# EAGLE design v3_NoD_2 (EAGLE 9.5.2)
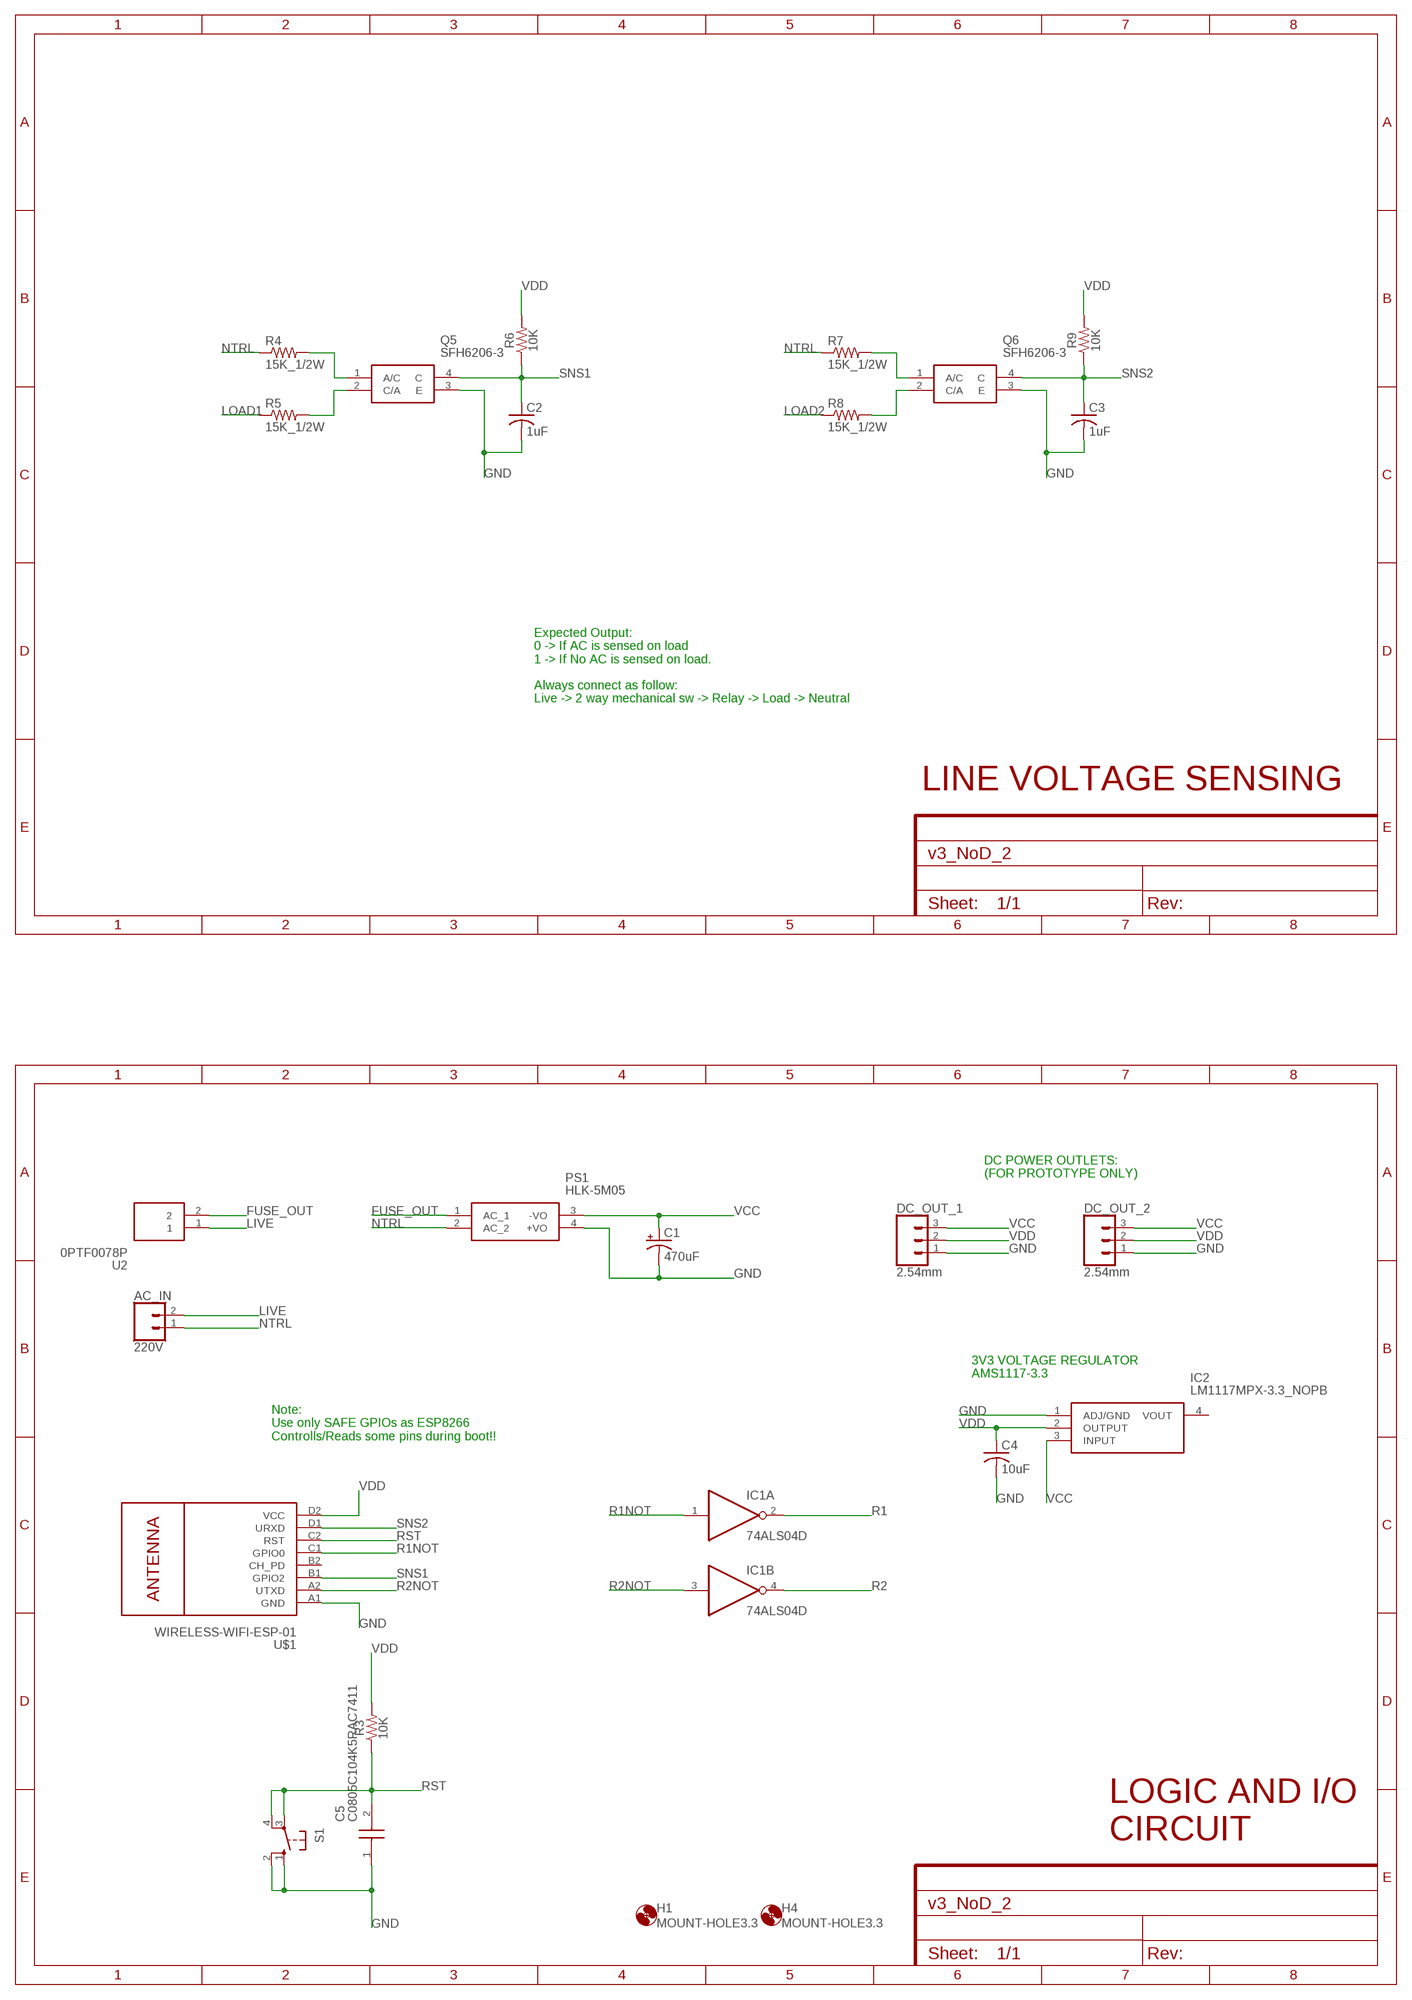
[diagram p0: schematic, sheet 1, part 1 of 2]
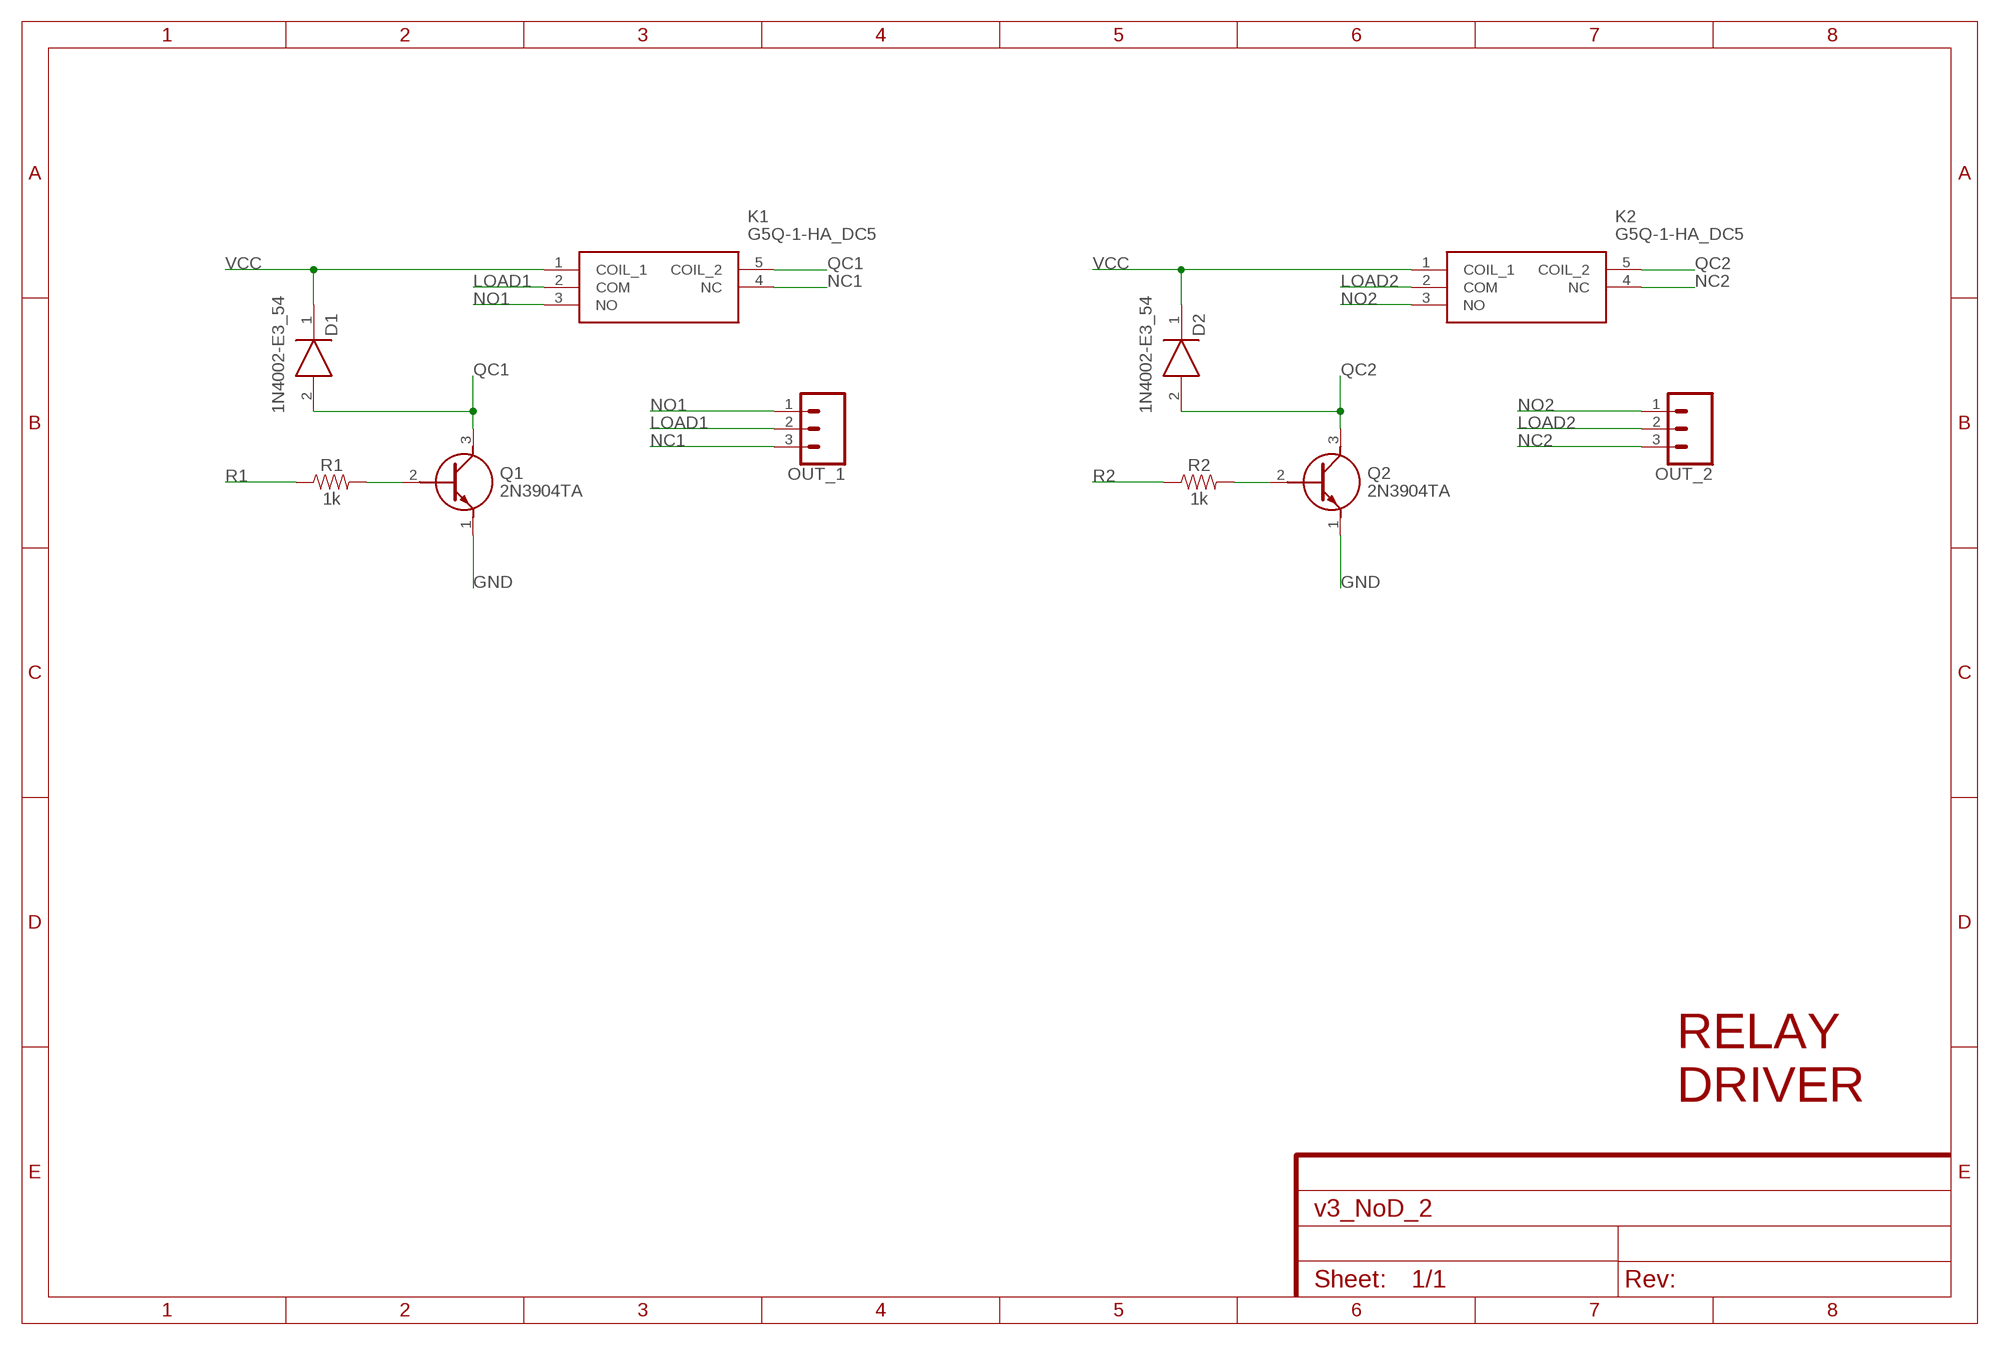
[diagram p1: schematic, sheet 1, part 2 of 2]

## Parts
AC_IN  220V  CONN_025MM  [SCREWTERMINAL-5MM-2]
C1  470uF  1000UF-RADIAL-5MM-35V-20%-KIT  [CPOL-RADIAL-5MM-10MM-KIT]
C2  1uF  C-USC0805  [C0805]
C3  1uF  C-USC0805  [C0805]
C4  10uF  C-USC0805  [C0805]
C5  C0805C104K5RAC7411  [CAPC2012X88N]
D1  1N4002-E3_54  [DIOAD1405W86L465D235]
D2  1N4002-E3_54  [DIOAD1405W86L465D235]
DC_OUT_1  2.54mm  CONN_03  [1X03]
DC_OUT_2  2.54mm  CONN_03  [1X03]
H1  MOUNT-HOLE3.3  [3,3]
H4  MOUNT-HOLE3.3  [3,3]
IC1  74ALS04D  [SO14]
IC2  LM1117MPX-3.3_NOPB  [SOT230P700X180-4N]
K1  G5Q-1-HA_DC5  [G5Q1EU12DC]
K2  G5Q-1-HA_DC5  [G5Q1EU12DC]
OUT_1  CONN_03-SCREW-5MM  [SCREWTERMINAL-5MM-3]
OUT_2  CONN_03-SCREW-5MM  [SCREWTERMINAL-5MM-3]
PS1  HLK-5M05  [HLK5M05]
Q1  2N3904TA  [BC33740TA]
Q2  2N3904TA  [BC33740TA]
Q5  SFH6206-3  [SOP254P1005X410-4N]
Q6  SFH6206-3  [SOP254P1005X410-4N]
R1  1k  1KOHM-0603-1/10W-1%  [0603]
R2  1k  1KOHM-0603-1/10W-1%  [0603]
R3  10K  1KOHM-0603-1/10W-1%  [0603]
R4  15K_1/2W  R-US_R1210  [R1210]
R5  15K_1/2W  R-US_R1210  [R1210]
R6  10K  1KOHM-0603-1/10W-1%  [0603]
R7  15K_1/2W  R-US_R1210  [R1210]
R8  15K_1/2W  R-US_R1210  [R1210]
R9  10K  1KOHM-0603-1/10W-1%  [0603]
S1  10-XX  [B3F-10XX]
U2  0PTF0078P  [0PTF0078P]
U$1  WIRELESS-WIFI-ESP-01  [WIRELESS-WIFI-ESP-01]

## Nets
FUSE_OUT: PS1.1(AC_1) U2.2
GND: C1.- C2.2 C3.2 C4.2 C5.1 DC_OUT_1.1 DC_OUT_2.1 IC2.1(ADJ/GND) PS1.4(+VO) Q1.1(E) Q2.1(E) Q5.3(E) Q6.3(E) S1.1(S) S1.2(S1) U$1.A1(GND)
LIVE: AC_IN.2 U2.1
LOAD1: K1.2(COM) OUT_1.2 R5.1
LOAD2: K2.2(COM) OUT_2.2 R8.1
N$1: Q5.1(A/C) R4.2
N$2: Q5.2(C/A) R5.2
N$3: Q6.1(A/C) R7.2
N$4: Q1.2(B) R1.2
N$5: Q2.2(B) R2.2
N$6: Q6.2(C/A) R8.2
NC1: K1.4(NC) OUT_1.3
NC2: K2.4(NC) OUT_2.3
NO1: K1.3(NO) OUT_1.1
NO2: K2.3(NO) OUT_2.1
NTRL: AC_IN.1 PS1.2(AC_2) R4.1 R7.1
QC1: D1.2(A) K1.5(COIL_2) Q1.3(C)
QC2: D2.2(A) K2.5(COIL_2) Q2.3(C)
R1: IC1.2(A:O) R1.1
R1NOT: IC1.1(A:I) U$1.C1(GPIO0)
R2: IC1.4(B:O) R2.1
R2NOT: IC1.3(B:I) U$1.A2(UTXD)
RST: C5.2 R3.1 S1.3(P) S1.4(P1) U$1.C2(RST)
SNS1: C2.1 Q5.4(C) R6.1 U$1.B1(GPIO2)
SNS2: C3.1 Q6.4(C) R9.1 U$1.D1(URXD)
VCC: C1.+ D1.1(K) D2.1(K) DC_OUT_1.3 DC_OUT_2.3 IC2.3(INPUT) K1.1(COIL_1) K2.1(COIL_1) PS1.3(-VO)
VDD: C4.1 DC_OUT_1.2 DC_OUT_2.2 IC2.2(OUTPUT) R3.2 R6.2 R9.2 U$1.D2(VCC)
Unconnected: IC1.5(C:I) IC1.6(C:O) IC1.8(D:O) IC1.9(D:I) IC1.10(E:O) IC1.11(E:I) IC1.12(F:O) IC1.13(F:I) IC2.4(VOUT) U$1.B2(CH_PD)

## Notes on the sheet
- Expected Output:
  0 -> If AC is sensed on load
  1 -> If No AC is sensed on load.
  
  Always connect as follow:
  Live -> 2 way mechanical sw -> Relay -> Load -> Neutral
- LINE VOLTAGE SENSING
- DC POWER OUTLETS:
  (FOR PROTOTYPE ONLY)
- 3V3 VOLTAGE REGULATOR
  AMS1117-3.3
- Note:
  Use only SAFE GPIOs as ESP8266
  Controlls/Reads some pins during boot!!
- RELAY
  DRIVER
- LOGIC AND I/O
  CIRCUIT

## Power pins joined to a net without a drawn wire
GND: IC1.7(P:GND)
VCC: IC1.14(P:VCC)

## Library data of the parts
AC_IN = SparkFun-Connectors:CONN_02: Multi connection point. Often used as Generic Header-pin footprint for 0.1 inch spaced/style header connections On any of the 0.1 inch spaced packages, you can populate with these: Break Away Headers - Straight <https://www.sparkfun.com/products/116> (PRT-00116) Break Away Male Headers - Right Angle <https://www.sparkfun.com/products/553> (PRT-00553) Female Headers <https://www.sparkfun.com/products/115> (PRT-00115) Break Away Headers - Machine Pin <https://www.sparkfun.com/products/117> (PRT-00117) Break Away Female Headers - Swiss Machine Pin <https://www.sparkfun.com/products/743> (PRT-00743) For SCREWTERMINALS and SPRING TERMINALS visit here: Screw Terimnals on SparkFun.com <https://www.sparkfun.com/search/results?term=Screw+Terminals> (5mm/3.5mm/2.54mm spacing) This device is also useful as a general connection point to wire up your design to another part of your project. Our various solder wires solder well into these plated through hole pads. Hook-Up Wire - Assortment (Stranded, 22 AWG) <https://www.sparkfun.com/products/11375> (PRT-11375) Hook-Up Wire - Assortment (Solid Core, 22 AWG) <https://www.sparkfun.com/products/11367> (PRT-11367) View the entire wire category on our website here <https://www.sparkfun.com/categories/141> Special notes: Molex polarized connector foot print use with: PRT-08233 with associated crimp pins and housings. 2.54_SCREWTERM for use with PRT-10571. 3.5mm Screw Terminal footprints for PRT-08084 5mm Screw Terminal footprints for use with PRT-08432; SF_SKU: PRT-08432
C1 = SparkFun-Capacitors:1000UF: 1,000µF/1mF ceramic capacitors A capacitor is a passive two-terminal electrical component used to store electrical energy temporarily in an electric field. CAP-08070; PROD_ID: CAP-09538; VALUE: 1mf
C2-C4 = rcl:C-US: CAPACITOR, American symbol; SPICEPREFIX: C
C5 = SamacSys_Parts:C0805C104K5RAC7411: Cap Ceramic 0.1uF 50V X7R 10% Pad SMD 0805 125C T/R Source: Datasheet; DESCRIPTION: Cap Ceramic 0.1uF 50V X7R 10% Pad SMD 0805 125C T/R; HEIGHT: 0.88mm; MANUFACTURER_NAME: Kemet; MANUFACTURER_PART_NUMBER: C0805C104K5RAC7411; MOUSER_PART_NUMBER: 80-C0805C104K5RACLR; MOUSER_PRICE-STOCK: https://www.mouser.co.uk/ProductDetail/KEMET/C0805C104K5RAC7411?qs=jbRM9o5BbzPcVXF0wW9AYg%3D%3D
D1 D2 = SamacSys_Parts:1N4002-E3_54: VISHAY - 1N4002-E3/54 - STANDARD DIODE, 1A, 100V, DO-204AL, FULL REEL Source: Datasheet <https://componentsearchengine.com/Datasheets/2/1N4002-E3_54.pdf>; DESCRIPTION: VISHAY - 1N4002-E3/54 - STANDARD DIODE, 1A, 100V, DO-204AL, FULL REEL; HEIGHT: mm; MANUFACTURER_NAME: Vishay; MANUFACTURER_PART_NUMBER: 1N4002-E3/54; MOUSER_PART_NUMBER: 625-1N4002-E3/54; MOUSER_PRICE-STOCK: https://www.mouser.co.uk/ProductDetail/Vishay-Semiconductors/1N4002-E3-54?qs=N4vtoAxH%2FSqs13dJhGS5gw%3D%3D
DC_OUT_1 DC_OUT_2 = SparkFun-Connectors:CONN_03: Multi connection point. Often used as Generic Header-pin footprint for 0.1 inch spaced/style header connections On any of the 0.1 inch spaced packages, you can populate with these: Break Away Headers - Straight <https://www.sparkfun.com/products/116> (PRT-00116) Break Away Male Headers - Right Angle <https://www.sparkfun.com/products/553> (PRT-00553) Female Headers <https://www.sparkfun.com/products/115> (PRT-00115) Break Away Headers - Machine Pin <https://www.sparkfun.com/products/117> (PRT-00117) Break Away Female Headers - Swiss Machine Pin <https://www.sparkfun.com/products/743> (PRT-00743) Stackable Header - 3 Pin (Female, 0.1") <https://www.sparkfun.com/products/13875> (PRT-13875) For SCREWTERMINALS and SPRING TERMINALS visit here: Screw Terimnals on SparkFun.com <https://www.sparkfun.com/search/results?term=Screw+Terminals> (5mm/3.5mm/2.54mm spacing) This device is also useful as a general connection point to wire up your design to another part of your project. Our various solder wires solder well into these plated through hole pads. Hook-Up Wire - Assortment (Stranded, 22 AWG) <https://www.sparkfun.com/products/11375> (PRT-11375) Hook-Up Wire - Assortment (Solid Core, 22 AWG) <https://www.sparkfun.com/products/11367> (PRT-11367) View the entire wire category on our website here <https://www.sparkfun.com/categories/141> Special notes: Molex polarized connector foot print use with SKU : PRT-08232 with associated crimp pins and housings.; PROD_ID: XXX-00000; VALUE: 455-1750-1-ND
H1 H4 = holes:MOUNT-HOLE: MOUNTING HOLE with drill center marker
IC1 = 74xx-us:74*04: Hex INVERTER
IC2 = SamacSys_Parts:LM1117MPX-3.3_NOPB: Space saving 800-mA low-dropout linear regulator with internal current limit Source: Datasheet <http://www.ti.com/lit/ds/symlink/lm1117.pdf>; DESCRIPTION: Space saving 800-mA low-dropout linear regulator with internal current limit; HEIGHT: 1.8mm; MANUFACTURER_NAME: Texas Instruments; MANUFACTURER_PART_NUMBER: LM1117MPX-3.3/NOPB; MOUSER_PART_NUMBER: 926-LM1117MPX3.3NOPB; MOUSER_PRICE-STOCK: https://www.mouser.co.uk/ProductDetail/Texas-Instruments/LM1117MPX-33-NOPB?qs=X1J7HmVL2ZHRbBIxXi4utg%3D%3D
K1 K2 = SamacSys_Parts:G5Q-1-HA_DC5: General Purpose Relays PCB Power Relay Mini 1-pole 10A Source: Datasheet <https://omronfs.omron.com/en_US/ecb/products/pdf/en-g5q.pdf>; DESCRIPTION: General Purpose Relays PCB Power Relay Mini 1-pole 10A; HEIGHT: 15.8mm; MANUFACTURER_NAME: Omron Electronics; MANUFACTURER_PART_NUMBER: G5Q-1-HA DC5; MOUSER_PART_NUMBER: 653-G5Q-1-HADC5; MOUSER_PRICE-STOCK: https://www.mouser.co.uk/ProductDetail/Omron-Electronics/G5Q-1-HA-DC5?qs=xZ%2FP%252Ba9zWqZWP6NLX9Nrlg%3D%3D
OUT_1 OUT_2 = SparkFun-Connectors:CONN_03: Multi connection point. Often used as Generic Header-pin footprint for 0.1 inch spaced/style header connections On any of the 0.1 inch spaced packages, you can populate with these: Break Away Headers - Straight <https://www.sparkfun.com/products/116> (PRT-00116) Break Away Male Headers - Right Angle <https://www.sparkfun.com/products/553> (PRT-00553) Female Headers <https://www.sparkfun.com/products/115> (PRT-00115) Break Away Headers - Machine Pin <https://www.sparkfun.com/products/117> (PRT-00117) Break Away Female Headers - Swiss Machine Pin <https://www.sparkfun.com/products/743> (PRT-00743) Stackable Header - 3 Pin (Female, 0.1") <https://www.sparkfun.com/products/13875> (PRT-13875) For SCREWTERMINALS and SPRING TERMINALS visit here: Screw Terimnals on SparkFun.com <https://www.sparkfun.com/search/results?term=Screw+Terminals> (5mm/3.5mm/2.54mm spacing) This device is also useful as a general connection point to wire up your design to another part of your project. Our various solder wires solder well into these plated through hole pads. Hook-Up Wire - Assortment (Stranded, 22 AWG) <https://www.sparkfun.com/products/11375> (PRT-11375) Hook-Up Wire - Assortment (Solid Core, 22 AWG) <https://www.sparkfun.com/products/11367> (PRT-11367) View the entire wire category on our website here <https://www.sparkfun.com/categories/141> Special notes: Molex polarized connector foot print use with SKU : PRT-08232 with associated crimp pins and housings.; PROD_ID: CONN-10134; SF_SKU: PRT-08433
PS1 = SamacSys_Parts:HLK-5M05: 5W ultra-compact power module HLK-5M05 Source: Datasheet <http://www.hlktech.net/product_detail.php?ProId=60>; ARROW_PART_NUMBER: HLK-5M05; DESCRIPTION: 5W ultra-compact power module HLK-5M05; HEIGHT: 18mm; MANUFACTURER_NAME: Hi-Link; MANUFACTURER_PART_NUMBER: HLK-5M05
Q1 Q2 = SamacSys_Parts:2N3904TA: Transistor GP BJT NPN 40V 0.2A TO92-3 Source: Datasheet <http://www.onsemi.com/pub/Collateral/2N3904-D.pdf>; DESCRIPTION: Transistor GP BJT NPN 40V 0.2A TO92-3; HEIGHT: mm; MANUFACTURER_NAME: ON Semiconductor; MANUFACTURER_PART_NUMBER: 2N3904TA; MOUSER_PART_NUMBER: 512-2N3904TA; MOUSER_PRICE-STOCK: https://www.mouser.co.uk/ProductDetail/ON-Semiconductor-Fairchild/2N3904TA?qs=ljbEvF4DwOOn1Ev%2FzRYaoA%3D%3D
Q5 Q6 = SamacSys_Parts:SFH6206-3: SMD-4 CPLR 100-320% CTR -e3 Source: Datasheet <https://componentsearchengine.com/Datasheets/1/SFH6206-3.pdf>; DESCRIPTION: SMD-4 CPLR 100-320% CTR -e3; HEIGHT: 4.1mm; MANUFACTURER_NAME: Vishay; MANUFACTURER_PART_NUMBER: SFH6206-3; MOUSER_PART_NUMBER: 782-SFH6206-3; MOUSER_PRICE-STOCK: https://www.mouser.com/Search/Refine.aspx?Keyword=782-SFH6206-3
R1 R2 = SparkFun-Resistors:1KOHM: 1kΩ resistor A resistor is a passive two-terminal electrical component that implements electrical resistance as a circuit element. Resistors act to reduce current flow, and, at the same time, act to lower voltage levels within circuits. - Wikipedia; PROD_ID: RES-07856
R3 R6 R9 = SparkFun-Resistors:1KOHM: 1kΩ resistor A resistor is a passive two-terminal electrical component that implements electrical resistance as a circuit element. Resistors act to reduce current flow, and, at the same time, act to lower voltage levels within circuits. - Wikipedia; PROD_ID: RES-07856; VALUE: 1k
R4 R5 R7 R8 = rcl:R-US_: RESISTOR, American symbol; SPICEPREFIX: R
S1 = switch-omron:10-XX: OMRON SWITCH; MPN: B3F-1000; OC_FARNELL: 176432; OC_NEWARK: 36M3542
U2 = SamacSys_Parts:0PTF0078P: FUSEHOLDER-OPEN 5X20MM UL94V0 PITCH 22/6 Source: Datasheet <https://media.digikey.com/pdf/Data Sheets/Littelfuse PDFs/PTF075_77_78.pdf>; DESCRIPTION: FUSEHOLDER-OPEN 5X20MM UL94V0 PITCH 22/6; HEIGHT: 11.5mm; MANUFACTURER_NAME: LITTELFUSE; MANUFACTURER_PART_NUMBER: 0PTF0078P; MOUSER_PART_NUMBER: 576-0PTF0078P; MOUSER_PRICE-STOCK: https://www.mouser.co.uk/ProductDetail/Littelfuse/0PTF0078P?qs=Co4VkB5J4%2Fsczy6gG8s%2FsA%3D%3D
U$1 = ESP-01:WIRELESS-WIFI-ESP-01: Wireless Wi-Fi ESP-01 Module based on ESP8266 chip Click here to find device on ebay.com <http://www.ebay.com/sch/esp8266+esp+01+transceiver>

## Board
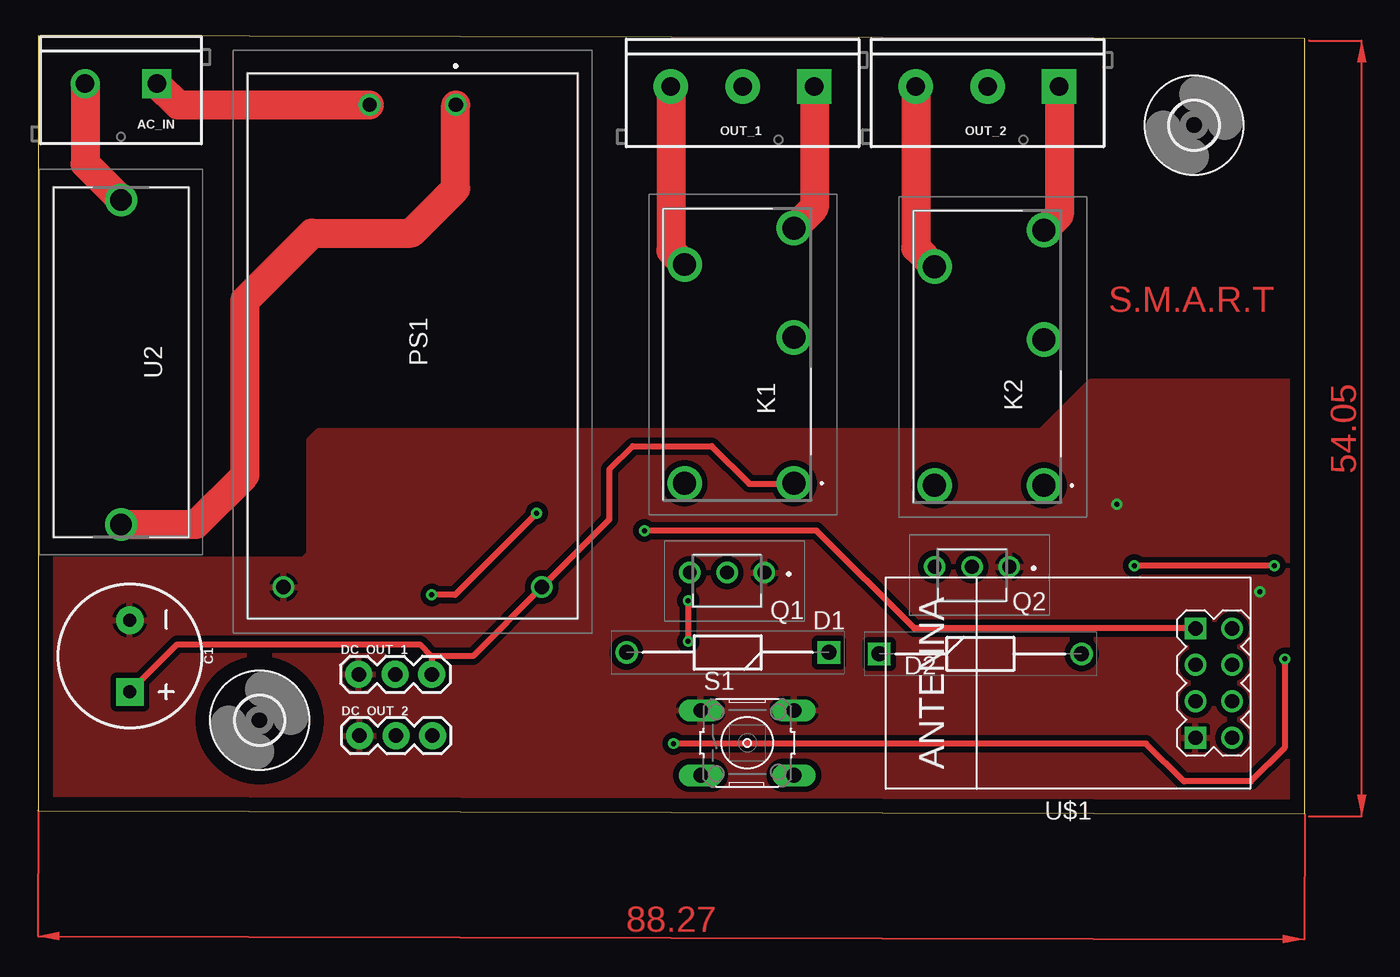
[diagram p2: board, top side]
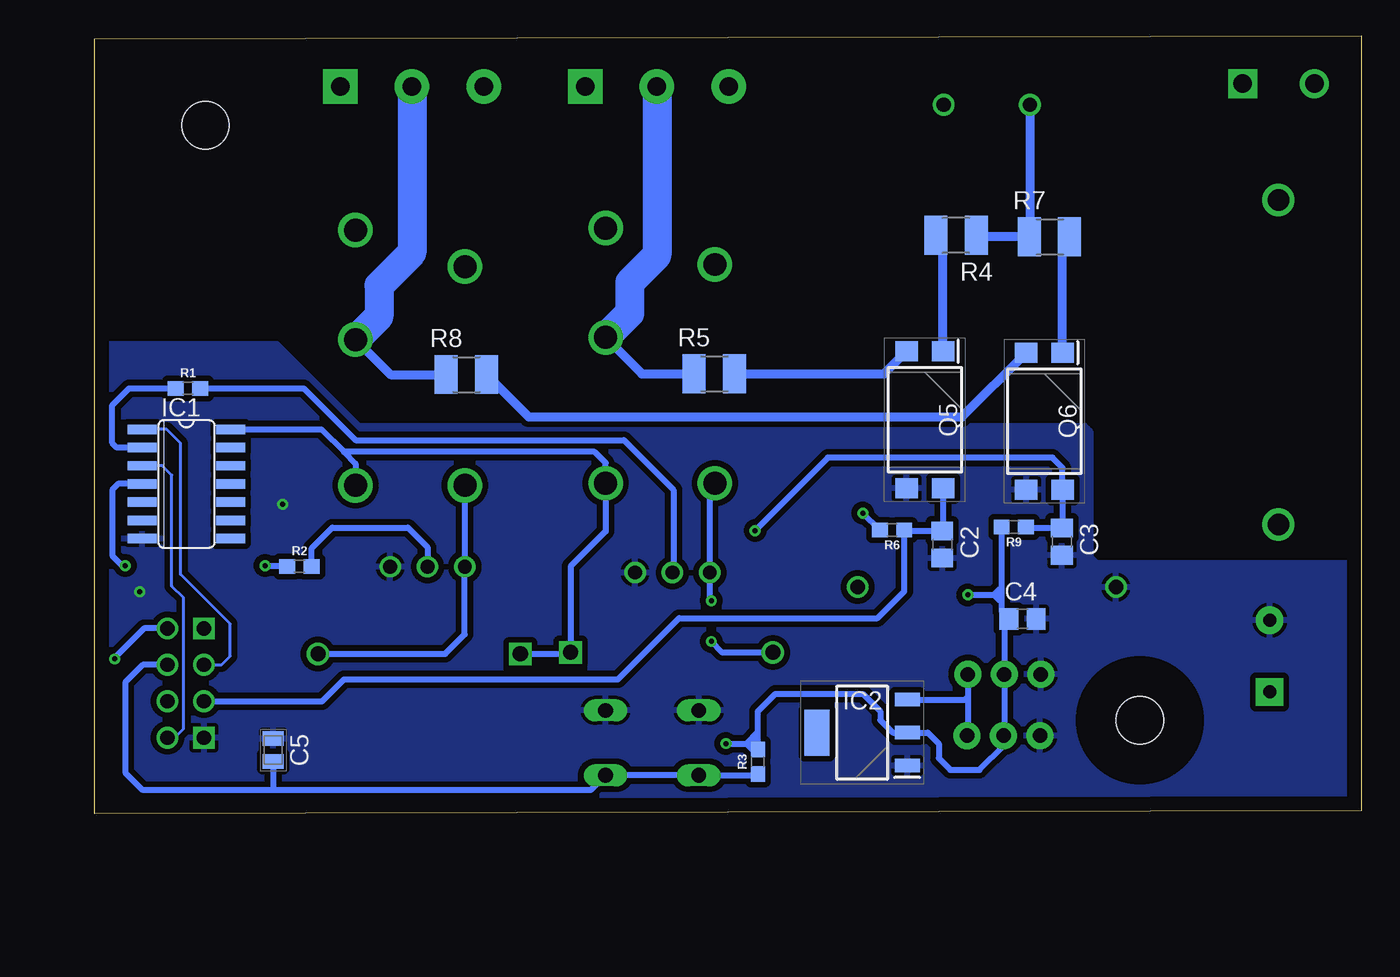
[diagram p3: board, bottom side, seen from below]

Size 88.27 x 54.18 mm. Coordinates in mm from the lower left corner, seen from the top.
Outline: 0,0.2 88.27,0 88.27,53.98 0,54.18 0,0.2
Copper layers (1*16): Top 0.035mm / dielectric 1.5mm / Bottom 0.035mm
Design rules "default": minimum track width 6mil, minimum drill 0.35mm, track to track 6mil, track to pad 6mil, pad to pad 6mil, via to via 6mil, smd to smd 6mil, copper to edge 40mil, drill to drill 6mil, minimum pad ring 10mil, minimum via ring 8mil, stop-mask expansion 4mil, vias tented up to drill 0mil, thermal gap 10mil

### Footprints (pad centres in the part's own frame; a part is rotated, then mirrored left to right if it is on the bottom)
SCREWTERMINAL-5MM-2 = drill 1.3 pad 2.032 square: 1 0,0 | drill 1.3 pad 2.032: 2 5,0
CPOL-RADIAL-5MM-10MM-KIT = drill 0.9 pad 1.93 square: + 2.5,0 | drill 0.9 pad 1.93: - -2.5,0
C0805 = smd 1.3 x 1.5: 1 -0.95,0; 2 0.95,0
CAPC2012X88N = smd 1.02 x 1.47: 1 -0.8,0; 2 0.8,0
DIOAD1405W86L465D235 = drill 1.05 pad 1.575 square: 1 0,0 | drill 1.05 pad 1.575: 2 14.1,0
1X03 = drill 1.016 pad 1.88: 1 0,0; 2 2.54,0; 3 5.08,0
3,3 = hole 3.3: 0,0
SO14 = smd 0.66 x 2.032: 1 -3.81,-3.073; 2 -2.54,-3.073; 3 -1.27,-3.073; 4 0,-3.073; 5 1.27,-3.073; 6 2.54,-3.073; 7 3.81,-3.073; 8 3.81,3.073; 9 2.54,3.073; 10 1.27,3.073; 11 0,3.073; 12 -1.27,3.073; 13 -2.54,3.073; 14 -3.81,3.073
SOT230P700X180-4N = smd 1.75 x 0.95: 1 -3.15,2.3; 2 -3.15,0; 3 -3.15,-2.3 | smd 1.75 x 3.2: 4 3.15,0
G5Q1EU12DC = drill 1.6 pad 2.4: 1 0,0; 2 10.16,0; 3 17.78,0; 4 15.24,7.62; 5 0,7.62
SCREWTERMINAL-5MM-3 = drill 1.3 pad 2.413 square: 1 0,0 | drill 1.3 pad 2.413: 2 5,0; 3 10,0
HLK5M05 = drill 1 pad 1.5: 1 0,0; 2 0,-6; 3 33.6,6; 4 33.6,-12
BC33740TA = drill 0.96 pad 1.493: 1 -1.7,-0.585; 2 0.9,-0.585; 3 3.5,-0.585
SOP254P1005X410-4N = smd 1.4 x 1.55: 1 -4.775,1.27; 2 -4.775,-1.27; 3 4.775,-1.27; 4 4.775,1.27
0603 = smd 1.1 x 1: 1 -0.85,0; 2 0.85,0
R1210 = smd 1.6 x 2.7: 1 -1.4,0; 2 1.4,0
B3F-10XX = drill 1.016 long: 1 -3.251,2.261; 2 3.251,2.261; 3 -3.251,-2.261; 4 3.251,-2.261
0PTF0078P = drill 1.5 pad 2.25: 1 -11.3,0; 2 11.3,0
WIRELESS-WIFI-ESP-01 = drill 1 square: A1 -8.89,3.81; D1 -8.89,-3.81 | drill 1: A2 -11.43,3.81; B1 -8.89,1.27; B2 -11.43,1.27; C1 -8.89,-1.27; C2 -11.43,-1.27; D2 -11.43,-3.81

### Placement (x,y rotation side)
AC_IN  8.28,50.85 180 top
C1  6.4,10.97 270 top
C2  29.21,18.75 270 bottom
C3  20.88,18.95 270 bottom
C4  23.62,13.56 0 bottom
C5  75.84,4.42 270 bottom
D1  55.12,11.23 180 top
D2  58.62,11.13 0 top
DC_OUT_1  22.35,9.7 0 top
DC_OUT_2  22.4,5.44 0 top
H1  80.57,47.96 0 top
H4  15.44,6.5 0 top
IC1  81.89,22.96 270 bottom
IC2  34.8,5.64 180 bottom
K1  52.68,23.01 90 top
K2  70.1,22.86 90 top
OUT_1  54.1,50.65 180 top
OUT_2  71.17,50.65 180 top
PS1  29.11,49.38 270 top
Q1  48.92,16.21 180 top
Q2  65.99,16.61 180 top
Q5  30.43,27.43 270 bottom
Q6  22.1,27.33 270 bottom
R1  81.79,29.62 0 bottom
R2  74.02,17.22 0 bottom
R3  42.06,3.61 90 bottom
R4  28.24,40.28 180 bottom
R5  45.11,30.63 0 bottom
R6  32.72,19.76 180 bottom
R7  21.74,40.18 0 bottom
R8  62.38,30.58 0 bottom
R9  24.23,19.96 180 bottom
S1  49.43,4.93 0 top
U2  5.79,31.45 270 top
U$1  71.78,9.09 180 top

### Tracks (layer width: path | path; a pad name or v marks a point on that pad's centre or on a via)
FUSE_OUT
  Top 2.032: U2.2 11,20.15 14.43,23.57 14.43,35.76 19.1,40.44 26.01,40.44 29.11,43.54 PS1.1
GND  (via drill 0.35)
  other vias: 75.18,21.54 85.14,15.44
  pour Bottom (isolate 0.406): 0,0.2 87.99,0.2 88.19,0 88.19,32.72 75.59,32.72 69.9,27.03 19.3,27.03 19.1,26.82 18.9,26.62 18.9,17.88 18.49,17.48 0,17.48
  pour Top (isolate 0.406): 0,17.68 0,0.2 88.19,0.2 88.19,30.07 73.96,30.07 73.36,30.07 69.9,26.62 19.51,26.62 18.9,26.01 18.9,18.08 18.49,17.68
LIVE
  Top 2.032: AC_IN.2 3.28,45.26 U2.1
LOAD1
  Bottom 0.61: K1.2 50.14,30.63 R5.1
  Bottom 2.032: OUT_1.2 49.1,38.88 51,36.98 51,34.85 K1.2
LOAD2
  Bottom 0.61: K2.2 67.67,30.58 R8.1
  Bottom 2.032: OUT_2.2 66.17,39.09 68.48,36.78 68.48,34.65 K2.2
N$1
  Bottom 0.61: Q5.1 29.16,39.8 R4.2
N$2
  Bottom 0.61: R5.2 33.27,30.63 Q5.2
N$3
  Bottom 0.61: Q6.1 20.83,39.7 R7.2
N$4
  Bottom 0.406: R1.2 73.71,29.62 70.1,26.01 51.41,26.01 47.95,22.56 47.95,16.86 Q1.2
N$5
  Bottom 0.406: R2.2 73.15,17.24 73.15,18.49 71.73,19.91 66.45,19.91 65.09,18.56 Q2.2
N$6
  Bottom 0.61: R8.2 58.04,27.64 27.84,27.64 Q6.2
NC1
  Top 2.032: OUT_1.3 44.1,39.21 K1.4
NC2
  Top 2.032: OUT_2.3 61.17,39.41 K2.4
NO1
  Top 2.032: OUT_1.1 54.1,42.22 K1.3
NO2
  Top 2.032: OUT_2.1 71.17,41.71 K2.3
NTRL
  Top 2.032: AC_IN.1 9.75,49.38 PS1.2
  Bottom 0.61: PS1.2 23.11,40.22 | 23.11,40.22 R7.1 | R4.1 26.78,40.22 23.11,40.22
QC1  (via drill 0.35)
  Top 0.406: v45.31,14.83 v45.31,11.99
  Bottom 0.406: K1.5 45.42,22.65 Q1.3 45.42,14.94 v45.31,14.83 | v45.31,11.99 44.55,11.23 D1.2
QC2
  Bottom 0.406: K2.5 Q2.3 62.49,12.49 63.86,11.13 D2.2
R1
  Bottom 0.406: IC1.2 86.75,25.5 87.05,25.81 87.05,28.45 85.88,29.62 R1.1
R1NOT
  Bottom 0.203: U$1.C1 79.45,10.36 78.84,10.97 78.84,13.21 82.3,16.66 82.3,25.81 83.26,26.77 IC1.1
R2  (via drill 0.35)
  Top 0.406: v86.16,17.27 v76.4,17.27
  Bottom 0.406: IC1.4 86.64,22.96 87.05,22.56 87.05,17.96 86.36,17.27 v86.16,17.27 | v76.4,17.27 74.92,17.27 R2.1
R2NOT
  Bottom 0.203: U$1.A2 82.7,5.28 82.09,5.89 82.09,15.04 82.91,15.85 82.91,23.57 83.57,24.23 IC1.3
RST
  Bottom 0.406: U$1.C2 84.94,10.36 86.16,9.14 86.16,2.85 84.94,1.63 75.79,1.63 | R3.1 42.15,2.67 S1.3 S1.4 53.72,1.63 75.79,1.63 | C5.2 75.84,1.68 75.79,1.63
SNS1
  Bottom 0.406: Q5.4 29.16,19.75 C2.1 31.8,19.7 R6.1 31.86,15.48 33.73,13.61 47.55,13.61 51.82,9.35 70.92,9.35 72.44,7.82 U$1.B1
SNS2  (via drill 0.35)
  Top 0.406: U$1.D1 61.06,12.9 54.25,19.71 v42.27,19.71
  Bottom 0.406: R9.1 23.32,19.9 C3.1 20.83,19.95 Q6.4 20.83,24.08 21.54,24.79 37.19,24.79 v42.27,19.71
VCC
  Top 0.406: C1.+ 9.71,11.79 26.62,11.79 27.43,10.97 | 27.43,10.97 DC_OUT_1.3 | K1.1 52.63,22.96 49.58,22.96 46.94,25.6 41.45,25.6 39.83,23.98 39.83,20.5 PS1.3 30.3,10.97 27.43,10.97
  Bottom 0.406: DC_OUT_1.3 27.43,8.13 | 27.43,8.13 27.43,5.49 DC_OUT_2.3 | IC2.3 27.62,7.94 27.43,8.13 | IC1.14 72.49,26.77 70.92,25.2 | K2.1 70.1,24.38 70.92,25.2 | 70.92,25.2 53.44,25.2 52.68,24.44 K1.1 52.68,19.66 55.12,17.22 D1.1 55.22,11.13 D2.1
VDD  (via drill 0.35)
  Top 0.406: v86.88,10.77 86.88,4.58 84.53,2.24 79.86,2.24 77.22,4.88 v44.3,4.88 | v34.75,20.93 29.06,15.24 v27.43,15.24
  Bottom 0.406: R9.2 25.08,15.24 | 25.08,15.24 25.08,14.07 C4.1 24.89,13.24 DC_OUT_1.2 24.89,5.49 | 24.89,5.49 DC_OUT_2.2 | 24.89,5.49 24.89,4.78 26.62,3.05 28.65,3.05 29.46,3.86 29.46,4.88 30.23,5.64 IC2.2 32.66,5.64 33.53,6.5 33.53,7.11 34.75,8.33 40.84,8.33 42.06,7.11 42.06,5.69 | R3.2 42.06,4.88 | 42.06,4.88 42.06,5.69 | U$1.D2 84.84,12.9 86.97,10.77 v86.88,10.77 | v44.3,4.88 42.88,4.88 | 42.88,4.88 42.06,4.88 | 42.06,5.69 42.88,4.88 | 42.88,4.88 42.27,4.27 42.27,5.08 | R6.2 34.73,20.93 v34.75,20.93 | v27.43,15.24 25.6,15.24 | 25.6,15.24 25.08,15.24 | 25.6,15.24 25.2,15.65 | 25.6,15.24 25.2,14.83
(copper drawn outside any net)
  shapes: Top area x2

### Text on the board
Top: S.M.A.R.T